# Altium project roTDSP.PrjPcb
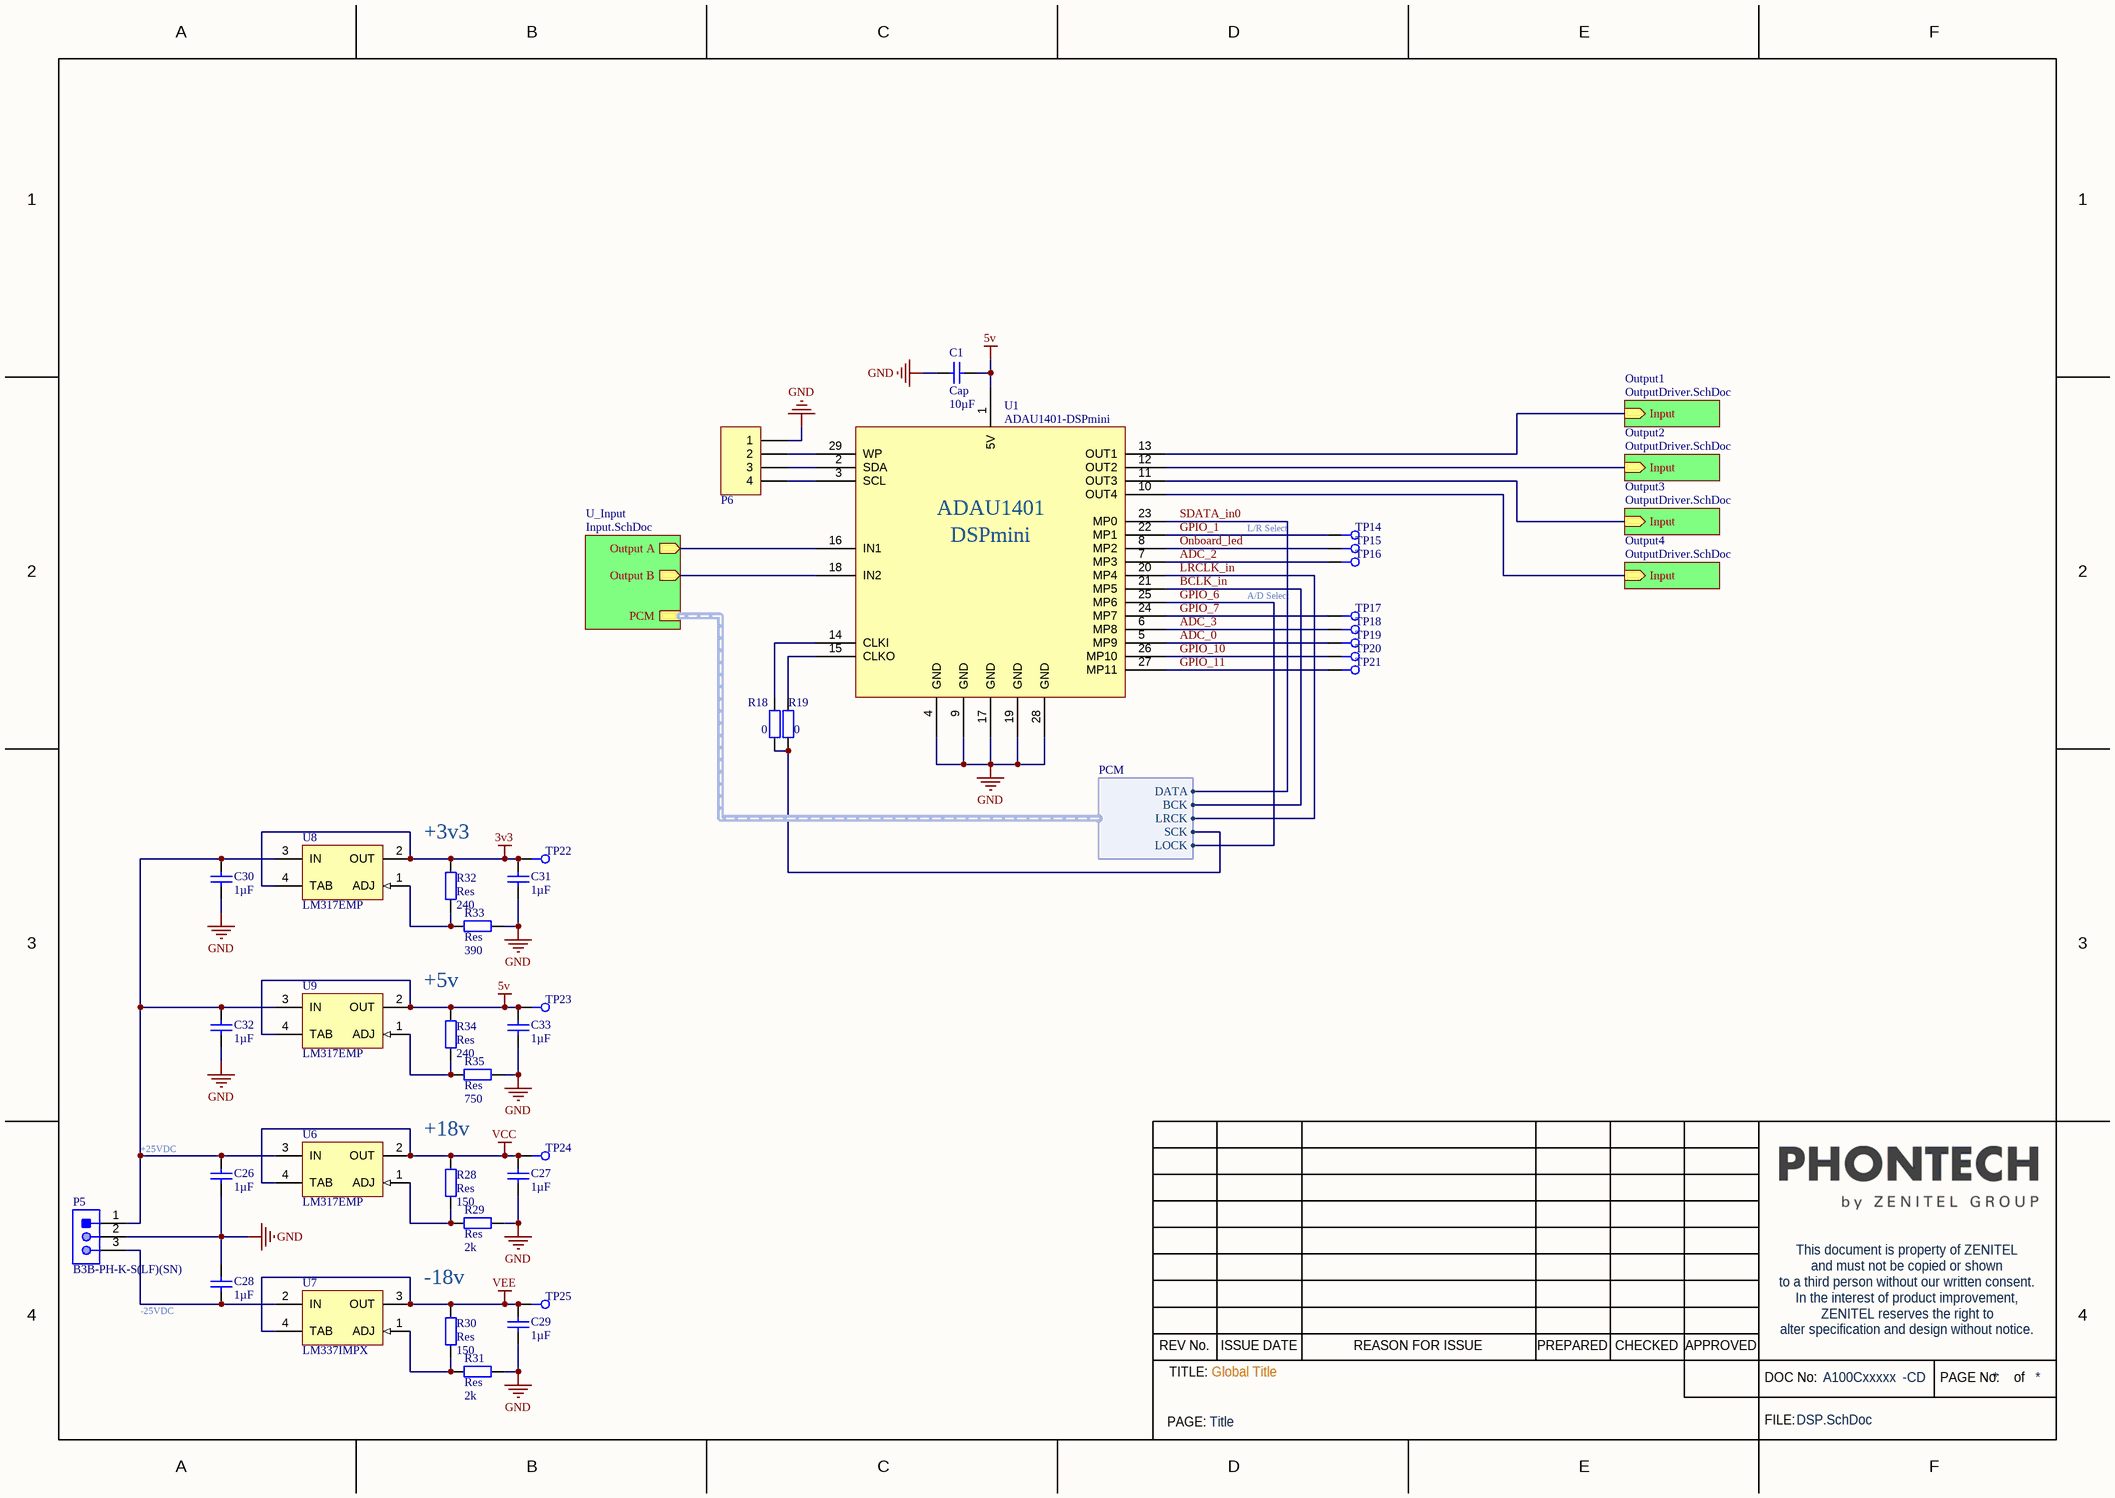
[diagram p0: DSP.SchDoc]
GLOBAL_DOCUMENT_NO: A100Cxxxxx; GLOBAL_TITLE_1: Global Title
3 sheets, 148 parts. Net scope: hierarchical (ports join the sheet entries above them; power ports are global).
Board file: roTDSP.PcbDoc
Sheets:
  DSP.SchDoc
    Output1 = OutputDriver.SchDoc
    Output2 = OutputDriver.SchDoc
    Output3 = OutputDriver.SchDoc
    Output4 = OutputDriver.SchDoc
    U_Input = Input.SchDoc

## Sheet DSP.SchDoc: Title
size 396 x 279 mm; PageSetup: Record=PageOptions|CenterHorizontal=True|CenterVertical=True|PrintScale=1.00|XCorrection=1.00|YCorrection=1.00|PrintKind=0|BorderSize=5000000|LeftOffset=0|BottomOffset=0|Orientation=2|PaperLength=1000|PaperWidth=1000|Scale=100|PaperSource=7|PrintQuality=-4|MediaType=1|DitherType=10|PaperKind=A3|PrintScaleMode=0

### Parts
C1  Cap  value 10µF  [CAPC2013X140X50NL20T25]
C26  value 1µF  [CAPC3225N]  (hidden comment: Cap)
C27  value 1µF  [CAPC3225N]  (hidden comment: Cap)
C28  value 1µF  [CAPC3225N]  (hidden comment: Cap)
C29  value 1µF  [CAPC3225N]  (hidden comment: Cap)
C30  value 1µF  [CAPC3225N]  (hidden comment: Cap)
C31  value 1µF  [CAPC3225N]  (hidden comment: Cap)
C32  value 1µF  [CAPC3225N]  (hidden comment: Cap)
C33  value 1µF  [CAPC3225N]  (hidden comment: Cap)
P5  B3B-PH-K-S(LF)(SN)  [JST-B3B-PH-K-S-3_V]
P6  Header 4  [TSW-104-14-S-S]  (value not drawn)
R18  value 0  [RESC3216X60X45NL10T20]  (hidden comment: Res)
R19  value 0  [RESC3216X60X45NL10T20]  (hidden comment: Res)
R28  Res  value 150  [RESC1005X40X25NL05T05]
R29  Res  value 2k  [RESC1005X40X25NL05T05]
R30  Res  value 150  [RESC1005X40X25NL05T05]
R31  Res  value 2k  [RESC1005X40X25NL05T05]
R32  Res  value 240  [RESC1005X40X25NL05T05]
R33  Res  value 390  [RESC1005X40X25NL05T05]
R34  Res  value 240  [RESC1005X40X25NL05T05]
R35  Res  value 750  [RESC1005X40X25NL05T05]
TP14  TP Ø1.0MM  [TP_1MM]  (value not drawn)  (no BOM)
TP15  TP Ø1.0MM  [TP_1MM]  (value not drawn)  (no BOM)
TP16  TP Ø1.0MM  [TP_1MM]  (value not drawn)  (no BOM)
TP17  TP Ø1.0MM  [TP_1MM]  (value not drawn)  (no BOM)
TP18  TP Ø1.0MM  [TP_1MM]  (value not drawn)  (no BOM)
TP19  TP Ø1.0MM  [TP_1MM]  (value not drawn)  (no BOM)
TP20  TP Ø1.0MM  [TP_1MM]  (value not drawn)  (no BOM)
TP21  TP Ø1.0MM  [TP_1MM]  (value not drawn)  (no BOM)
TP22  TP Ø1.0MM  [TP_1MM]  (value not drawn)  (no BOM)
TP23  TP Ø1.0MM  [TP_1MM]  (value not drawn)  (no BOM)
TP24  TP Ø1.0MM  [TP_1MM]  (value not drawn)  (no BOM)
TP25  TP Ø1.0MM  [TP_1MM]  (value not drawn)  (no BOM)
U1  ADAU1401-DSPmini  [ADAU1401-DSPmini]
U6  LM317EMP  [SOT223-4N]
U7  LM337IMPX  [DCY0004A_N]
U8  LM317EMP  [SOT223-4N]
U9  LM317EMP  [SOT223-4N]

### Sub-sheets
Output1 = OutputDriver.SchDoc: Input (in)
Output2 = OutputDriver.SchDoc: Input (in)
Output3 = OutputDriver.SchDoc: Input (in)
Output4 = OutputDriver.SchDoc: Input (in)
U_Input = Input.SchDoc: Output A (out), Output B (out), PCM (harness PCM)

### Harnesses
PCM: DATA, BCK, LRCK, SCK, LOCK

### Nets
3v3: C31.2 R32.2 TP22.1 U8.2(OUT) U8.4(TAB)
5v: C1.2 C33.2 R34.2 TP23.1 U1.1(5V) U9.2(OUT) U9.4(TAB)
GND: C1.1 C26.1 C27.1 C28.2 C29.1 C30.1 C31.1 C32.1 C33.1 P5.2 P6.1 R29.1 R31.1 R33.2 R35.2 U1.4(GND) U1.9(GND) U1.17(GND) U1.19(GND) U1.28(GND)
VCC: C27.2 R28.2 TP24.1 U6.2(OUT) U6.4(TAB)
VEE: C29.2 R30.2 TP25.1 U7.3(OUT) U7.4(TAB)
ADC_0: TP19.1 U1.5(MP9)
ADC_2: TP16.1 U1.7(MP3)
ADC_3: TP18.1 U1.6(MP8)
BCLK_in: U1.21(MP5) ; sheet U_Input/PCM.BCK
GPIO_1: TP14.1 U1.22(MP1)
GPIO_6: U1.25(MP6) ; sheet U_Input/PCM.LOCK
GPIO_7: TP17.1 U1.24(MP7)
GPIO_10: TP20.1 U1.26(MP10)
GPIO_11: TP21.1 U1.27(MP11)
LRCLK_in: U1.20(MP4) ; sheet U_Input/PCM.LRCK
Onboard_led: TP15.1 U1.8(MP2)
SDATA_in0: U1.23(MP0) ; sheet U_Input/PCM.DATA
NetC26_2: C26.2 C30.2 C32.2 P5.1 U6.3(IN) U8.3(IN) U9.3(IN)
NetC28_1: C28.1 P5.3 U7.2(IN)
NetP6_2: P6.2 U1.29(WP)
NetP6_3: P6.3 U1.2(SDA)
NetP6_4: P6.4 U1.3(SCL)
NetR1A_2: U1.13(OUT1) ; sheet Output1/Input
NetR1B_2: U1.12(OUT2) ; sheet Output2/Input
NetR1C_2: U1.11(OUT3) ; sheet Output3/Input
NetR1D_2: U1.10(OUT4) ; sheet Output4/Input
NetR18_1: R18.1 U1.14(CLKI)
NetR18_2: R18.2 R19.2 ; sheet U_Input/PCM.SCK
NetR19_1: R19.1 U1.15(CLKO)
NetR28_1: R28.1 R29.2 U6.1(ADJ)
NetR30_1: R30.1 R31.2 U7.1(ADJ)
NetR32_1: R32.1 R33.1 U8.1(ADJ)
NetR34_1: R34.1 R35.1 U9.1(ADJ)
NetU1_16: U1.16(IN1) ; sheet U_Input/Output A
NetU1_18: U1.18(IN2) ; sheet U_Input/Output B

### Notes on the sheet
- L/R Select
- A/D Select
- +3v3
- +5v
- +25VDC
- +18v
- -25VDC
- -18v
- A
- B
- C
- D
- E
- F
- 1
- 2
- 3
- ZENITEL reserves the right to
- In the interest of product improvement,
- to a third person without our written consent.
- and must not be copied or shown
- This document is property of ZENITEL
- 4
- TITLE:
- REV No.
- ISSUE DATE
- REASON FOR ISSUE
- PREPARED
- CHECKED
- APPROVED
- DOC No:
- -CD
- alter specification and design without notice.
- PAGE No:
- of
- PAGE:
- FILE:
- (in symbol ADAU1401-DSPmini) ADAU1401; DSPmini

### Library data of the parts
C1 = CMP-CAP-00199-6: CR0805 10u 10V X7R 10% h=1.25mm; Zenitel PartNumber: 4000060821; Capacitor Type: Ceramic; Tolerance: 10%; Case/Package: 0805; Mount: SMD; Dielectric: X7R; Voltage: 10V; Pins: 2; RoHS: Yes
C26-C33 = CMP-CAP-00478-3: Chip cap 1uF 50v X7R 1210; Zenitel PartNumber: 4000084277; Tolerance: 10%; Capacitor Type: Ceramic; Case/Package: 1210; Dielectric: X7R; Voltage: 50V; Mount: SMD
P5 = CMP-2000-05164-1: Male Header, Pitch 2 mm, 1 x 3 Position, Height 6 mm, Tail Length 3.4 mm, -25 to 85 degC, RoHS, Bulk; Manufacturer: JST; Style/Orientation: StraightHeader/Plug; Pitch: 2mm; No of Positions: 3; Termination: Crimp; Manufacturer URL: http://www.jst.com/home2.html; Datasheet Version: Oct-06; Type: ShroudedHeader; Datasheet URL: https://datasheet.ciiva.com/11746/0900766b80826550-11746939.pdf
P6 = CMP-CON-00726-1: 4 Pin straight header; Zenitel PartNumber: 4000097756; Pitch: 2.54mm; Rows: 1; Mount: HOLE; Type: Header; Pins: 4; Series: TSW-series; Angle: Straight
R18 R19 = CMP-RES-00440-3: 0R 1206; Zenitel PartNumber: 4000085059; Power: 250mW; Tolerance: 0%; Case/Package: 1206; Mount: SMD
R28 R30 = CMP-RES-00033-4: Chip resistor 150R - 0402; Zenitel PartNumber: 4000081078; Tolerance: 1%; Power: 62.5mW; Voltage: 50V; Case/Package: 0402; Pins: 2; Mount: SMD; RoHS: Yes
R29 R31 = CMP-RES-00834-5: Chip resistor 2k 1% - 0402; Zenitel PartNumber: EGSMD80417; Voltage: 50V; Power: 63mW; Tolerance: 1%; Mount: SMT; RoHS: Yes; Pins: 2; Case/Package: 0402
R32 R34 = CMP-RES-01185-4: Chip resistor 240R 1% - 0402; Zenitel PartNumber: EGSMD80322; Voltage: 50V; Power: 63mW; Pins: 2; RoHS: Yes; Tolerance: 1%; Mount: SMT; Case/Package: 0402
R33 = CMP-RES-00038-4: Chip resistor 390R - 0402; Zenitel PartNumber: 4000081083; Tolerance: 5%; Power: 62.5mW; Voltage: 50V; Case/Package: 0402; Pins: 2; RoHS: Yes; Mount: SMD
R35 = CMP-RES-01205-4: Chip resistor 750R 1% - 0402; Zenitel PartNumber: EGSMD80353; Voltage: 50V; Power: 63mW; Mount: SMT; Pins: 2; RoHS: Yes; Tolerance: 1%; Case/Package: 0402
TP14-TP25 = CMP-ELMEC-00015-2: Test Point, copper pad, 1.0mm diameter; Type: TP; RoHS: Yes; Mount: SMD; Case/Package: Ø1mm
U6 U8 U9 = CMP-IC-00203-1: LM317EMP SOT223; Zenitel PartNumber: 4000084254; Mount: SMD
U7 = CMP-0062-01833-3: 3-Terminal Adjustable Negative Regulator, 4-pin SOT-223; Manufacturer: Texas Instruments; CompType: LDO IC; PowerWise: N; PackageTopMarking: XYTT*N02A; Code_IPC: SOT223-4; RoHS: N; PinCount: 4; PackageReference: DCY0004A; PackageDescription: Molded SOT-223, 6.50 x 3.56 x 1.6mm Body, 4 Lead, 2.3mm Pitch; ComponentLink1URL: http://www.ti.com/general/docs/lit/getliterature.tsp?genericPartNumber=LM337-N&fileType=pdf; ComponentLink1Description: Datasheet URL; Code_JEDEC: TO-261-AA

## Sheet OutputDriver.SchDoc: Title
size 396 x 279 mm; PageSetup: Record=PageOptions|CenterHorizontal=True|CenterVertical=True|PrintScale=1.00|XCorrection=1.00|YCorrection=1.00|PrintKind=0|BorderSize=5000000|LeftOffset=0|BottomOffset=0|Orientation=2|PaperLength=1000|PaperWidth=1000|Scale=100|PaperSource=7|PrintQuality=-4|MediaType=1|DitherType=10|PaperKind=A3|PrintScaleMode=0
Used 4 times, as channels Output1, Output2, Output3, Output4. Parts and nets are listed once, with the designators drawn on the sheet.
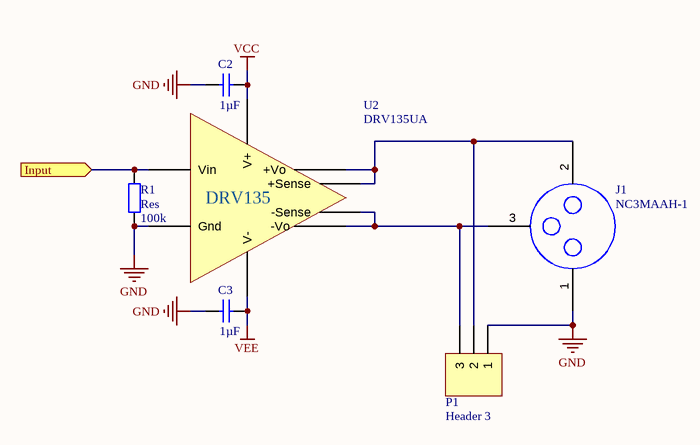
[diagram p1: OutputDriver.SchDoc]

### Parts
C2  value 1µF  [CAPC3225N]  (hidden comment: Cap)
C3  value 1µF  [CAPC3225N]  (hidden comment: Cap)
J1  NC3MAAH-1  [NC3MAAH-1]
P1  Header 3  [MTA-100-3P]
R1  Res  value 100k  [RESC1005X40X25NL05T05]
U2  DRV135UA  [SOIC127P600X360-8N]

### Ports
Input (in)

### Nets
GND: C2.1 C3.1 J1.1 P1.1 R1.1 U2.3(Gnd)
VCC: C2.2 U2.6(V+)
VEE: C3.2 U2.5(V-)
Input: R1.2 U2.4(Vin) ; port Input
NetJ1_2: J1.2 P1.2 U2.7(+Sense) U2.8(+Vo)
NetJ1_3: J1.3 P1.3 U2.1(-Vo) U2.2(-Sense)

### Channels
Output1: designators end in A; ports Input=NetR1A_2
Output2: designators end in B; ports Input=NetR1B_2
Output3: designators end in C; ports Input=NetR1C_2
Output4: designators end in D; ports Input=NetR1D_2

### Notes on the sheet
- A
- B
- C
- D
- E
- F
- 1
- 2
- 3
- ZENITEL reserves the right to
- In the interest of product improvement,
- to a third person without our written consent.
- and must not be copied or shown
- This document is property of ZENITEL
- 4
- TITLE:
- REV No.
- ISSUE DATE
- REASON FOR ISSUE
- PREPARED
- CHECKED
- APPROVED
- DOC No:
- -CD
- alter specification and design without notice.
- PAGE No:
- of
- PAGE:
- FILE:
- (in symbol CMP-IC-00071-3) DRV135

### Library data of the parts
C2 C3 = CMP-CAP-00478-3: as C26 on sheet DSP; Case/Package: 1210; Dielectric: X7R; Voltage: 50V; Mount: SMD
J1 = CMP-CON-00332-1: NC3MAAH-1 3pole male XLR 90deg; Zenitel PartNumber: 4000083185; Mount: HOLE
P1 = CMP-CON-00453-1: MTA-100-3P 3-pin header; Zenitel PartNumber: 4000085467; Rows: 1; Angle: Straight; Pitch: 2.54mm; Type: MTA header; Series: MTA; Pins: 3
R1 = CMP-RES-00067-4: Chip resistor 100K - 0402; Zenitel PartNumber: 4000081112; Power: 62.5mW; Tolerance: 1%; Voltage: 50V; Case/Package: 0402; Pins: 2; RoHS: Yes; Mount: SMD
U2 = CMP-IC-00071-3: Audio Amplifiers AUDIO LINE DRIVERS; Min Supply Voltage: 4.5V; Input Offset Voltage (Vos): 10mV; Quiescent Current: 5.2mA; Gain: 6dB; Interface: Analog; Common Mode Rejection Ratio: 46dB; Max Supply Voltage: 18V; Power Supply Rejection Ratio (PSRR): 80dB; Number of Elements: 3; Number of Channels: 1; Differential Output: Yes; Slew Rate: 15V/µs; Input Resistance: 10kR; Packaging: Rail/Tube; Mount: Surface Mount; Contact Plating: Gold; Number of Pins: 8; Package Quantity: 75; Max Operating Temperature: 125°C; Width: 3.91mm; Weight: 0.002677oz; RoHS: Yes; Number of Terminals: 8; Voltage: 18V; Lead Free: Lead Free; Max Dual Supply Voltage: 18V; Nominal Supply Current: 5.2mA; Case/Package: SOIC; Min Dual Supply Voltage: 4.5V; Min Operating Temperature: -55°C; Radiation Hardening: No; Voltage Gain: 6dB; Height: 1.58mm; REACH SVHC: No SVHC; Length: 4.9mm

## Sheet Input.SchDoc: Title
size 396 x 279 mm; PageSetup: Record=PageOptions|CenterHorizontal=True|CenterVertical=True|PrintScale=1.00|XCorrection=1.00|YCorrection=1.00|PrintKind=0|BorderSize=5000000|LeftOffset=0|BottomOffset=0|Orientation=2|PaperLength=1000|PaperWidth=1000|Scale=100|PaperSource=7|PrintQuality=-4|MediaType=1|DitherType=10|PaperKind=A3|PrintScaleMode=0
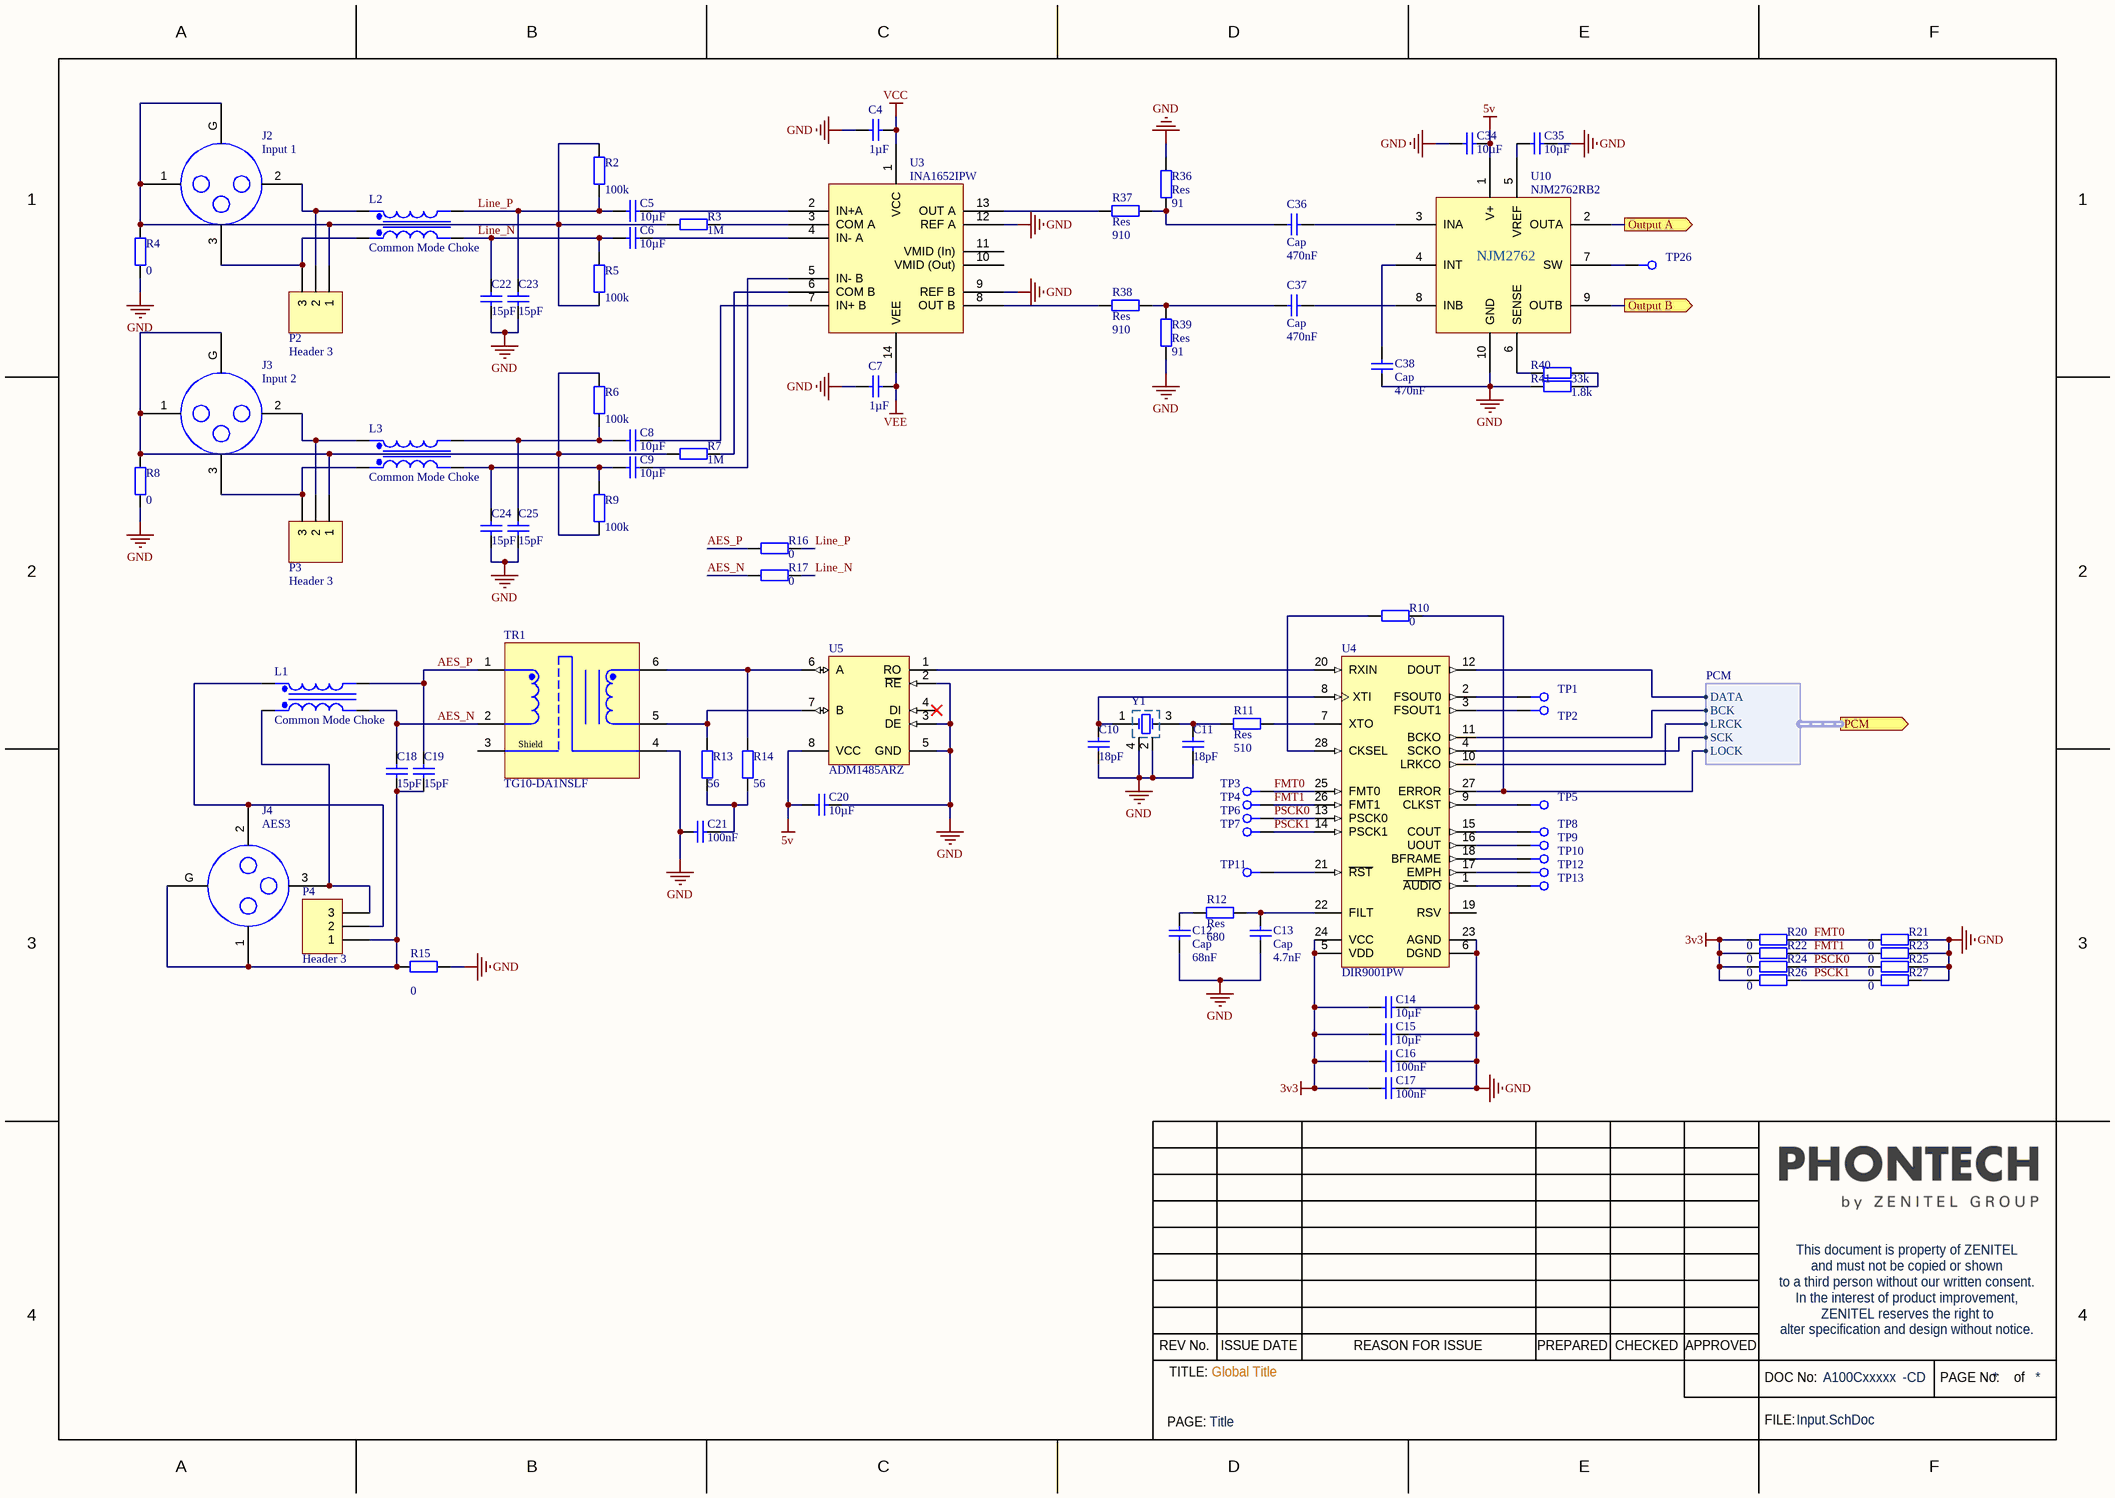
[diagram p2: Input.SchDoc]

### Parts
C4  value 1µF  [CAPC3225N]  (hidden comment: Cap)
C5  value 10µF  [CAPC5750N]  (hidden comment: Cap)
C6  value 10µF  [CAPC5750N]  (hidden comment: Cap)
C7  value 1µF  [CAPC3225N]  (hidden comment: Cap)
C8  value 10µF  [CAPC5750N]  (hidden comment: Cap)
C9  value 10µF  [CAPC5750N]  (hidden comment: Cap)
C10  value 18pF  [CAPC1005X56X25NL10T15]  (hidden comment: Cap)
C11  value 18pF  [CAPC1005X56X25NL10T15]  (hidden comment: Cap)
C12  Cap  value 68nF  [CAPC1005X56X25NL10T15]
C13  Cap  value 4.7nF  [CAPC1005X56X25NL10T15]
C14  value 10µF  [CAPC2013X140X50NL20T25]  (hidden comment: Cap)
C15  value 10µF  [CAPC2013X140X50NL20T25]  (hidden comment: Cap)
C16  value 100nF  [CAPC1005X56X25NL10T15]  (hidden comment: Cap)
C17  value 100nF  [CAPC1005X56X25NL10T15]  (hidden comment: Cap)
C18  value 15pF  [CAPC1005X56X25NL10T15]  (hidden comment: Cap)
C19  value 15pF  [CAPC1005X56X25NL10T15]  (hidden comment: Cap)
C20  value 10µF  [CAPC2013X140X50NL20T25]  (hidden comment: Cap)
C21  value 100nF  [CAPC1608X90X35NL15T15]  (hidden comment: Cap)
C22  value 15pF  [CAPC1005X56X25NL10T15]  (hidden comment: Cap)
C23  value 15pF  [CAPC1005X56X25NL10T15]  (hidden comment: Cap)
C24  value 15pF  [CAPC1005X56X25NL10T15]  (hidden comment: Cap)
C25  value 15pF  [CAPC1005X56X25NL10T15]  (hidden comment: Cap)
C34  value 10µF  [CAPC2013X140X50NL20T25]  (hidden comment: Cap)
C35  value 10µF  [CAPC2013X140X50NL20T25]  (hidden comment: Cap)
C36  Cap  value 470nF  [CAPC1608X90X35NL15T15]
C37  Cap  value 470nF  [CAPC1608X90X35NL15T15]
C38  Cap  value 470nF  [CAPC1608X90X35NL15T15]
J2  Input 1  [NC3FAH2]
J3  Input 2  [NC3FAH2]
J4  AES3  [NC3FAH2]
L1  Common Mode Choke  [WE-CNSW-1206]
L2  Common Mode Choke  [WE-CNSW-1206]
L3  Common Mode Choke  [WE-CNSW-1206]
P2  Header 3  [MTA-100-3P]
P3  Header 3  [MTA-100-3P]
P4  Header 3  [MTA-100-3P]
R2  value 100k  [RESC1005X40X25NL05T05]  (hidden comment: Res)
R3  value 1M  [RESC1005X40X25NL05T05]  (hidden comment: Res)
R4  value 0  [RESC3216X60X45NL10T20]  (hidden comment: Res)
R5  value 100k  [RESC1005X40X25NL05T05]  (hidden comment: Res)
R6  value 100k  [RESC1005X40X25NL05T05]  (hidden comment: Res)
R7  value 1M  [RESC1005X40X25NL05T05]  (hidden comment: Res)
R8  value 0  [RESC3216X60X45NL10T20]  (hidden comment: Res)
R9  value 100k  [RESC1005X40X25NL05T05]  (hidden comment: Res)
R10  value 0  [RESC1005X40X25NL05T05]  (hidden comment: Res)
R11  Res  value 510  [RESC1005X40X25NL05T05]
R12  Res  value 680  [RESC1005X40X25NL05T05]
R13  value 56  [RESC1609X50X30NL10T20]  (hidden comment: Res)
R14  value 56  [RESC1609X50X30NL10T20]  (hidden comment: Res)
R15  value 0  [RESC3216X60X45NL10T20]  (hidden comment: Res)
R16  value 0  [RESC3216X60X45NL10T20]  (hidden comment: Res)
R17  value 0  [RESC3216X60X45NL10T20]  (hidden comment: Res)
R20  value 0  [RESC1005X40X25NL05T05]  (hidden comment: Res)
R21  value 0  [RESC1005X40X25NL05T05]  (hidden comment: Res)
R22  value 0  [RESC1005X40X25NL05T05]  (hidden comment: Res)
R23  value 0  [RESC1005X40X25NL05T05]  (hidden comment: Res)
R24  value 0  [RESC1005X40X25NL05T05]  (hidden comment: Res)
R25  value 0  [RESC1005X40X25NL05T05]  (hidden comment: Res)
R26  value 0  [RESC1005X40X25NL05T05]  (hidden comment: Res)
R27  value 0  [RESC1005X40X25NL05T05]  (hidden comment: Res)
R36  Res  value 91  [RESC1609X50X30NL10T20]
R37  Res  value 910  [RESC1609X50X30NL10T20]
R38  Res  value 910  [RESC1609X50X30NL10T20]
R39  Res  value 91  [RESC1609X50X30NL10T20]
R40  value 33k  [RESC1005X40X25NL05T05]  (hidden comment: Res)
R41  value 1.8k  [RESC1005X40X25NL05T05]  (hidden comment: Res)
TP1  TP Ø1.27MM  [TP_1.27MM]  (value not drawn)  (no BOM)
TP2  TP Ø1.27MM  [TP_1.27MM]  (value not drawn)  (no BOM)
TP3  TP Ø1.27MM  [TP_1.27MM]  (value not drawn)  (no BOM)
TP4  TP Ø1.27MM  [TP_1.27MM]  (value not drawn)  (no BOM)
TP5  TP Ø1.27MM  [TP_1.27MM]  (value not drawn)  (no BOM)
TP6  TP Ø1.27MM  [TP_1.27MM]  (value not drawn)  (no BOM)
TP7  TP Ø1.27MM  [TP_1.27MM]  (value not drawn)  (no BOM)
TP8  TP Ø1.27MM  [TP_1.27MM]  (value not drawn)  (no BOM)
TP9  TP Ø1.27MM  [TP_1.27MM]  (value not drawn)  (no BOM)
TP10  TP Ø1.27MM  [TP_1.27MM]  (value not drawn)  (no BOM)
TP11  TP Ø1.27MM  [TP_1.27MM]  (value not drawn)  (no BOM)
TP12  TP Ø1.27MM  [TP_1.27MM]  (value not drawn)  (no BOM)
TP13  TP Ø1.27MM  [TP_1.27MM]  (value not drawn)  (no BOM)
TP26  TP Ø1.27MM  [TP_1.27MM]  (value not drawn)  (no BOM)
TR1  TG10-DA1NSLF  [TG10-DA1NSLF-Footprint-1]
U3  INA1652IPW  [SOP65P640X120-14N]
U4  DIR9001PW  [PW0028A_N]
U5  ADM1485ARZ  [ADI-R-8_M]
U10  NJM2762RB2  [SOP50P490X110-10N]
Y1  Crystal4  [XTAL-5x3.2MM]  (value not drawn)

### Ports
Output A (out), Output B (out), PCM (out, harness PCM)

### Harnesses
PCM: DATA, BCK, LRCK, SCK, LOCK

### Nets
3v3: C14.2 C15.2 C16.1 C17.1 R20.1 R22.1 R24.1 R26.1 U4.5(VDD) U4.24(VCC)
5v: C20.2 C34.1 U5.8(VCC) U10.1(V+)
GND: C4.1 C7.1 C10.1 C11.1 C12.1 C13.1 C14.1 C15.1 C16.2 C17.2 C20.1 C21.1 C22.1 C23.1 C24.1 C25.1 C34.2 C35.1 C38.1 R4.1 R8.1 R15.1 R21.2 R23.2 R25.2 R27.2 R36.2 R39.1 R41.1 TR1.4 U3.9(REF_B) U3.12(REF_A) U4.6(DGND) U4.23(AGND) U5.2(~{RE}) U5.3(DE) U5.5(GND) U10.10(GND) Y1.2(GND) Y1.4
VCC: C4.2 U3.1(VCC)
VEE: C7.2 U3.14(VEE)
AES_N: C18.2 L1.4 R17.2 TR1.2
AES_P: C19.2 L1.3 R16.2 TR1.1
BCLK_in: U4.11(BCKO) ; port PCM.BCK
FMT0: R20.2 R21.1 TP3.1 U4.25(FMT0)
FMT1: R22.2 R23.1 TP4.1 U4.26(FMT1)
GPIO_6: R10.2 U4.27(ERROR) ; port PCM.LOCK
Line_N: C6.1 C22.2 L2.4 R5.2 R17.1
Line_P: C5.1 C23.2 L2.3 R2.1 R16.1
LRCLK_in: U4.10(LRKCO) ; port PCM.LRCK
PSCK0: R24.2 R25.1 TP6.1 U4.13(PSCK0)
PSCK1: R26.2 R27.1 TP7.1 U4.14(PSCK1)
SDATA_in0: U4.12(DOUT) ; port PCM.DATA
NetC5_2: C5.2 U3.2(IN+A)
NetC6_2: C6.2 U3.4(IN-_A)
NetC8_1: C8.1 C25.2 L3.3 R6.1
NetC8_2: C8.2 U3.7(IN+_B)
NetC9_1: C9.1 C24.2 L3.4 R9.2
NetC9_2: C9.2 U3.5(IN-_B)
NetC10_2: C10.2 U4.8(XTI) Y1.1(OSC1)
NetC11_2: C11.2 R11.1 Y1.3(OSC2)
NetC12_2: C12.2 R12.1
NetC13_2: C13.2 R12.2 U4.22(FILT)
NetC18_1: C18.1 C19.1 J4.1 J4.G P4.1 R15.2
NetC21_2: C21.2 R13.1 R14.1
NetC35_2: C35.2 U10.5(VREF)
NetC36_1: C36.1 R36.1 R37.2
NetC36_2: C36.2 U10.3(INA)
NetC37_1: C37.1 R38.2 R39.2
NetC37_2: C37.2 U10.8(INB)
NetC38_2: C38.2 U10.4(INT)
NetJ2_1: J2.1 J2.G P2.1 R2.2 R3.1 R4.2 R5.1
NetJ2_2: J2.2 L2.2 P2.2
NetJ2_3: J2.3 L2.1 P2.3
NetJ3_1: J3.1 J3.G P3.1 R6.2 R7.1 R8.2 R9.1
NetJ3_2: J3.2 L3.2 P3.2
NetJ3_3: J3.3 L3.1 P3.3
NetJ4_2: J4.2 L1.2 P4.2
NetJ4_3: J4.3 L1.1 P4.3
NetR3_2: R3.2 U3.3(COM_A)
NetR7_2: R7.2 U3.6(COM_B)
NetR10_1: R10.1 U4.28(CKSEL)
NetR11_2: R11.2 U4.7(XTO)
NetR13_2: R13.2 TR1.5 U5.7(B)
NetR14_2: R14.2 TR1.6 U5.6(A)
NetR18_2: U4.4(SCKO) ; port PCM.SCK
NetR37_1: R37.1 U3.13(OUT_A)
NetR38_1: R38.1 U3.8(OUT_B)
NetR40_1: R40.1 R41.2
NetR40_2: R40.2 U10.6(SENSE)
NetTP1_1: TP1.1 U4.2(FSOUT0)
NetTP2_1: TP2.1 U4.3(FSOUT1)
NetTP5_1: TP5.1 U4.9(CLKST)
NetTP8_1: TP8.1 U4.15(COUT)
NetTP9_1: TP9.1 U4.16(UOUT)
NetTP10_1: TP10.1 U4.18(BFRAME)
NetTP11_1: TP11.1 U4.21(~{RST})
NetTP12_1: TP12.1 U4.17(EMPH)
NetTP13_1: TP13.1 U4.1(~{AUDIO})
NetTP26_1: TP26.1 U10.7(SW)
NetU1_16: U10.2(OUTA) ; port Output A
NetU1_18: U10.9(OUTB) ; port Output B
NetU4_20: U4.20(RXIN) U5.1(RO)

Not connected (* = marked no-connect by the designer): TR1 3; U3 10(VMID_(Out)) 11(VMID_(In)); U4 19(RSV); U5 4(DI)*

### Notes on the sheet
- A
- B
- C
- D
- E
- F
- 1
- 2
- 3
- ZENITEL reserves the right to
- In the interest of product improvement,
- to a third person without our written consent.
- and must not be copied or shown
- This document is property of ZENITEL
- 4
- TITLE:
- REV No.
- ISSUE DATE
- REASON FOR ISSUE
- PREPARED
- CHECKED
- APPROVED
- DOC No:
- -CD
- alter specification and design without notice.
- PAGE No:
- of
- PAGE:
- FILE:
- (in symbol CMP-TR-00015-1) Shield

### Library data of the parts
C4 C7 = CMP-CAP-00478-3: as C26 on sheet DSP; Case/Package: 1210; Dielectric: X7R; Voltage: 50V; Mount: SMD
C5 C6 C8 C9 = CMP-CAP-00538-3: 10UF, 100V, X7S, 2220; Zenitel PartNumber: 4000087361; Tolerance: 100%; Capacitor Type: Ceramic; Dielectric: X7S; Voltage: 100V; Case/Package: 2220; Mount: SMD
C10 C11 = CMP-CAP-00019-6: Chip cap 18p 50V - 0402; Zenitel PartNumber: 4000080916; Capacitor Type: Ceramic; Tolerance: 5%; Dielectric: NP0; Mount: SMD; RoHS: Yes; Case/Package: 0402; Pins: 2; Voltage: 50V
C12 = CMP-CAP-00050-6: Chip cap 68n 10V - 0402; Zenitel PartNumber: 4000080947; Dielectric: X5R; Capacitor Type: Ceramic; Tolerance: 100%; Voltage: 10V; Pins: 2; Case/Package: 0402; RoHS: Yes; Mount: SMD
C13 = CMP-CAP-00043-6: Chip cap 4700p 50V - 0402; Zenitel PartNumber: 4000080940; Capacitor Type: Ceramic; Tolerance: 100%; Dielectric: -; Voltage: 50V; Pins: 2; Mount: SMD; Case/Package: 0402; RoHS: Yes
C14 C15 C20 C34 C35 = CMP-CAP-00199-6: as C1 on sheet DSP; Tolerance: 10%; Case/Package: 0805; Mount: SMD; Dielectric: X7R; Voltage: 10V; Pins: 2; RoHS: Yes
C16 C17 = CMP-CAP-00051-6: Chip cap  100n 10V - 0402  X7R; Zenitel PartNumber: 4000080948; Tolerance: 10%; Capacitor Type: Ceramic; Pins: 2; RoHS: Yes; Mount: SMD; Dielectric: X7R; Voltage: 10V; Case/Package: 0402
C18 C19 C22-C25 = CMP-CAP-00859-5: Chip cap 15pF 50V NP0 - 0402; Zenitel PartNumber: EFSMD17120; Capacitor Type: Ceramic; Tolerance: 1%; Mount: SMT; RoHS: Yes; Dielectric: NP0; Pins: 2; Case/Package: 0402; Voltage: 50V
C21 = CMP-CAP-00096-6: Chip cap  100n 50V X7R - 0603; Zenitel PartNumber: 4000084734; Tolerance: 10%; Capacitor Type: Ceramic; Mount: SMD; Dielectric: X7R; Case/Package: 0603; Voltage: 50V; RoHS: Yes; Pins: 2
C36-C38 = CMP-CAP-00900-5: Chip cap 470nF 16V X7R - 0603; Zenitel PartNumber: EFSMD16664; Tolerance: 10%; Capacitor Type: Ceramic; Voltage: 16V; Pins: 2; RoHS: Yes; Mount: SMT; Case/Package: 0603; Dielectric: X7R
J2-J4 = CMP-CON-00344-1: NC3FAH2 3pole female XLR 90deg; Zenitel PartNumber: 4000083398; Mount: HOLE
L1-L3 = CMP-IND-00356-1: WE-CNSW SMD Common Mode Line Filter; Zenitel PartNumber: 4000086128; Current: 230mA; Type: Coil; Mount: SMD
P2-P4 = CMP-CON-00453-1: as P1 on sheet OutputDriver; Type: MTA header; Series: MTA; Pins: 3
R2 R5 R6 R9 = CMP-RES-00067-4: as R1 on sheet OutputDriver; Case/Package: 0402; Pins: 2; RoHS: Yes; Mount: SMD
R3 R7 = CMP-RES-00079-4: Chip resistor 1M 1% - 0402; Zenitel PartNumber: 4000081124; Voltage: 50V; Power: 62.5mW; Case/Package: 0402; Tolerance: 1%; Mount: SMD; Pins: 2; RoHS: Yes
R4 R8 R15-R17 = CMP-RES-00440-3: as R18 on sheet DSP; Case/Package: 1206; Mount: SMD
R10 R20-R27 = CMP-RES-00006-4: Chip resistor 0R - 0402; Zenitel PartNumber: 4000081051; Power: 62.5mW; Tolerance: 1%; Voltage: 50V; Case/Package: 0402; Pins: 2; Mount: SMD; RoHS: Yes
R11 = CMP-RES-00087-4: Chip resistor 0402 - 510R 1%; Zenitel PartNumber: 4000088250; Power: 62.5mW; Voltage: 50V; Case/Package: 0402; Tolerance: 1%; Pins: 2; RoHS: Yes; Mount: SMD
R12 = CMP-RES-00041-4: Chip resistor 680R - 0402; Zenitel PartNumber: 4000081086; Power: 62.5mW; Tolerance: 1%; Voltage: 50V; Case/Package: 0402; Pins: 2; RoHS: Yes; Mount: SMD
R13 R14 = CMP-RES-00152-3: CR 0603 56R 5%; Zenitel PartNumber: 4000098393; Power: 100mW; Mount: SMD; Case/Package: 0603; Tolerance: 5%
R36 R39 = CMP-RES-00157-3: CR 0603 91R 1%; Zenitel PartNumber: 4000098398; Power: 100mW; Tolerance: 1%; Case/Package: 0603; Mount: SMD
R37 R38 = CMP-RES-00181-3: CR 0603 910R 1%; Zenitel PartNumber: 4000098422; Power: 100mW; Mount: SMD; Case/Package: 0603; Tolerance: 1%
R40 = CMP-RES-00061-4: Chip resistor 33K - 0402; Zenitel PartNumber: 4000081106; Tolerance: 1%; Voltage: 50V; Power: 62.5mW; Case/Package: 0402; Pins: 2; Mount: SMD; RoHS: Yes
R41 = CMP-RES-00046-4: Chip resistor 1K8 - 0402; Zenitel PartNumber: 4000081091; Voltage: 50V; Tolerance: 1%; Power: 62.5mW; Case/Package: 0402; Mount: SMD; RoHS: Yes; Pins: 2
TP1-TP13 TP26 = CMP-ELMEC-00017-2: Test Point, copper pad, 1.27mm diameter; Type: TP; Mount: SMD; Case/Package: Ø1.27mm; RoHS: Yes
TR1 = CMP-TR-00015-1: Audio Transformers / Signal Transformers ISO MOD GullWng Sgl Audio w/ shield 6pin; Type: Digital audio; Ratio: 1:1; Pins: 6; Mount: SMD; RoHS: Yes
U3 = CMP-IC-00091-1: SoundPlus™ high common-mode rejection (91-dB), low THD+N (-120-dB) dual differential line receiver; RoHS: Yes; Mount: SMD; Pins: 14; Case/Package: TSSOP
U4 = CMP-0312-00068-2: 96 kHz Digital Audio Receiver, 50 ps Jitter, 3.3V, -40 to 85 degC, 28-Pin TSSOP (PW), Green (RoHS & no Sb/Br); Manufacturer: Texas Instruments; Supply Voltage(s)(V): 3.3; Jitter(ps): 50; Sampling Rate(Max)(kHz): 108; PackageVersion: revG, Feb-2011; ComponentLink2URL: http://www.ti.com/litv/pdf/mpds364; ComponentLink2Description: Package Specification; Code_JEDEC: MO-153; ComponentLink1Description: Datasheet; PackageReference: PW0028A; SubFamily: Digital Audio Receiver; PartNumber: DIR9001PW; ComponentLink1URL: http://www.ti.com/general/docs/lit/getliterature.tsp?genericPartNumber=DIR9001&fileType=pdf; Eco-Plan: Green (RoHS & no Sb/Br); PackageDescription: 28-Pin Plastic Thin Small Outline Package 9.7 x 4.4 mm Body ,0.65 mm Pitch; DatasheetVersion: SLES198; Mounting Technology: Surface Mount
U5 = CMP-0535-00061-1: Manufacturer: Analog Devices; Duplex: Half; Supply Voltage: 5; Number of Drivers: 1; Guaranteed Data Rate: 30 Mbps; Receiver Hysteresis: 50 mV; Packing: Tube; RoHS: TRUE; ComponentLink2Description: Datasheet; PackageDescription: 8-Pin Standard Small Outline Package, Body 4.9 x 3.9 mm, Pitch 1.27 mm; Mounting Technology: Surface Mount; ComponentLink1Description: Manufacturer URL; ComponentLink3Description: Package Specification; PartNumber: ADM1485ARZ; PackageVersion: 06/2006; Temperature Range: -40 to 85 degC; DatasheetVersion: Rev. E
U10 = CMP-IC-00078-4: 2-Channel Audio Limiter; Mount: SMD; Case/Package: MSOP10; RoHS: Yes; Pins: 10
Y1 = CMP-XTAL-00115-1: Crystal 24.576MHZ 18pF 5X3.2mm; Zenitel PartNumber: 4000086516; Frequency: 24,576MHz; Mount: HOLE; Type: Crystal

## Nets that join several sheets
3v3: DSP (5 pins), Input (10 pins)
5v: DSP (7 pins), Input (C20.2 C34.1 U5.8 U10.1)
GND: DSP (20 pins), Output1 (6 pins), Output2 (6 pins), Output3 (6 pins), Output4 (6 pins), Input (40 pins)
VCC: DSP (5 pins), Output1 (C2A.2 U2A.6), Output2 (C2B.2 U2B.6), Output3 (C2C.2 U2C.6), Output4 (C2D.2 U2D.6), Input (C4.2 U3.1)
VEE: DSP (5 pins), Output1 (C3A.2 U2A.5), Output2 (C3B.2 U2B.5), Output3 (C3C.2 U2C.5), Output4 (C3D.2 U2D.5), Input (C7.2 U3.14)
BCLK_in: DSP (U1.21), Input (U4.11)
GPIO_6: DSP (U1.25), Input (R10.2 U4.27)
LRCLK_in: DSP (U1.20), Input (U4.10)
NetR1A_2: DSP (U1.13), Output1 (R1A.2 U2A.4)
NetR1B_2: DSP (U1.12), Output2 (R1B.2 U2B.4)
NetR1C_2: DSP (U1.11), Output3 (R1C.2 U2C.4)
NetR1D_2: DSP (U1.10), Output4 (R1D.2 U2D.4)
NetR18_2: DSP (R18.2 R19.2), Input (U4.4)
NetU1_16: DSP (U1.16), Input (U10.2)
NetU1_18: DSP (U1.18), Input (U10.9)
SDATA_in0: DSP (U1.23), Input (U4.12)

## Assembly variants
Basic version: not fitted C10 C11 R18 R19 R21 R23 R25 R26 Y1